# Altium schematic sheet 23 Unused.SchDoc
size 420 x 297 mm; Address1: Address1; Address2: Address2; Address3: Address3; Address4: Address4; DocumentNumber: АБВГ.123456.001 Э3; SheetNumber: 23; SheetTotal: 23; Scale: 1:1; DocumentType: Схема электрическая принципиальная; FirstReferrence: АБВГ.123456.001
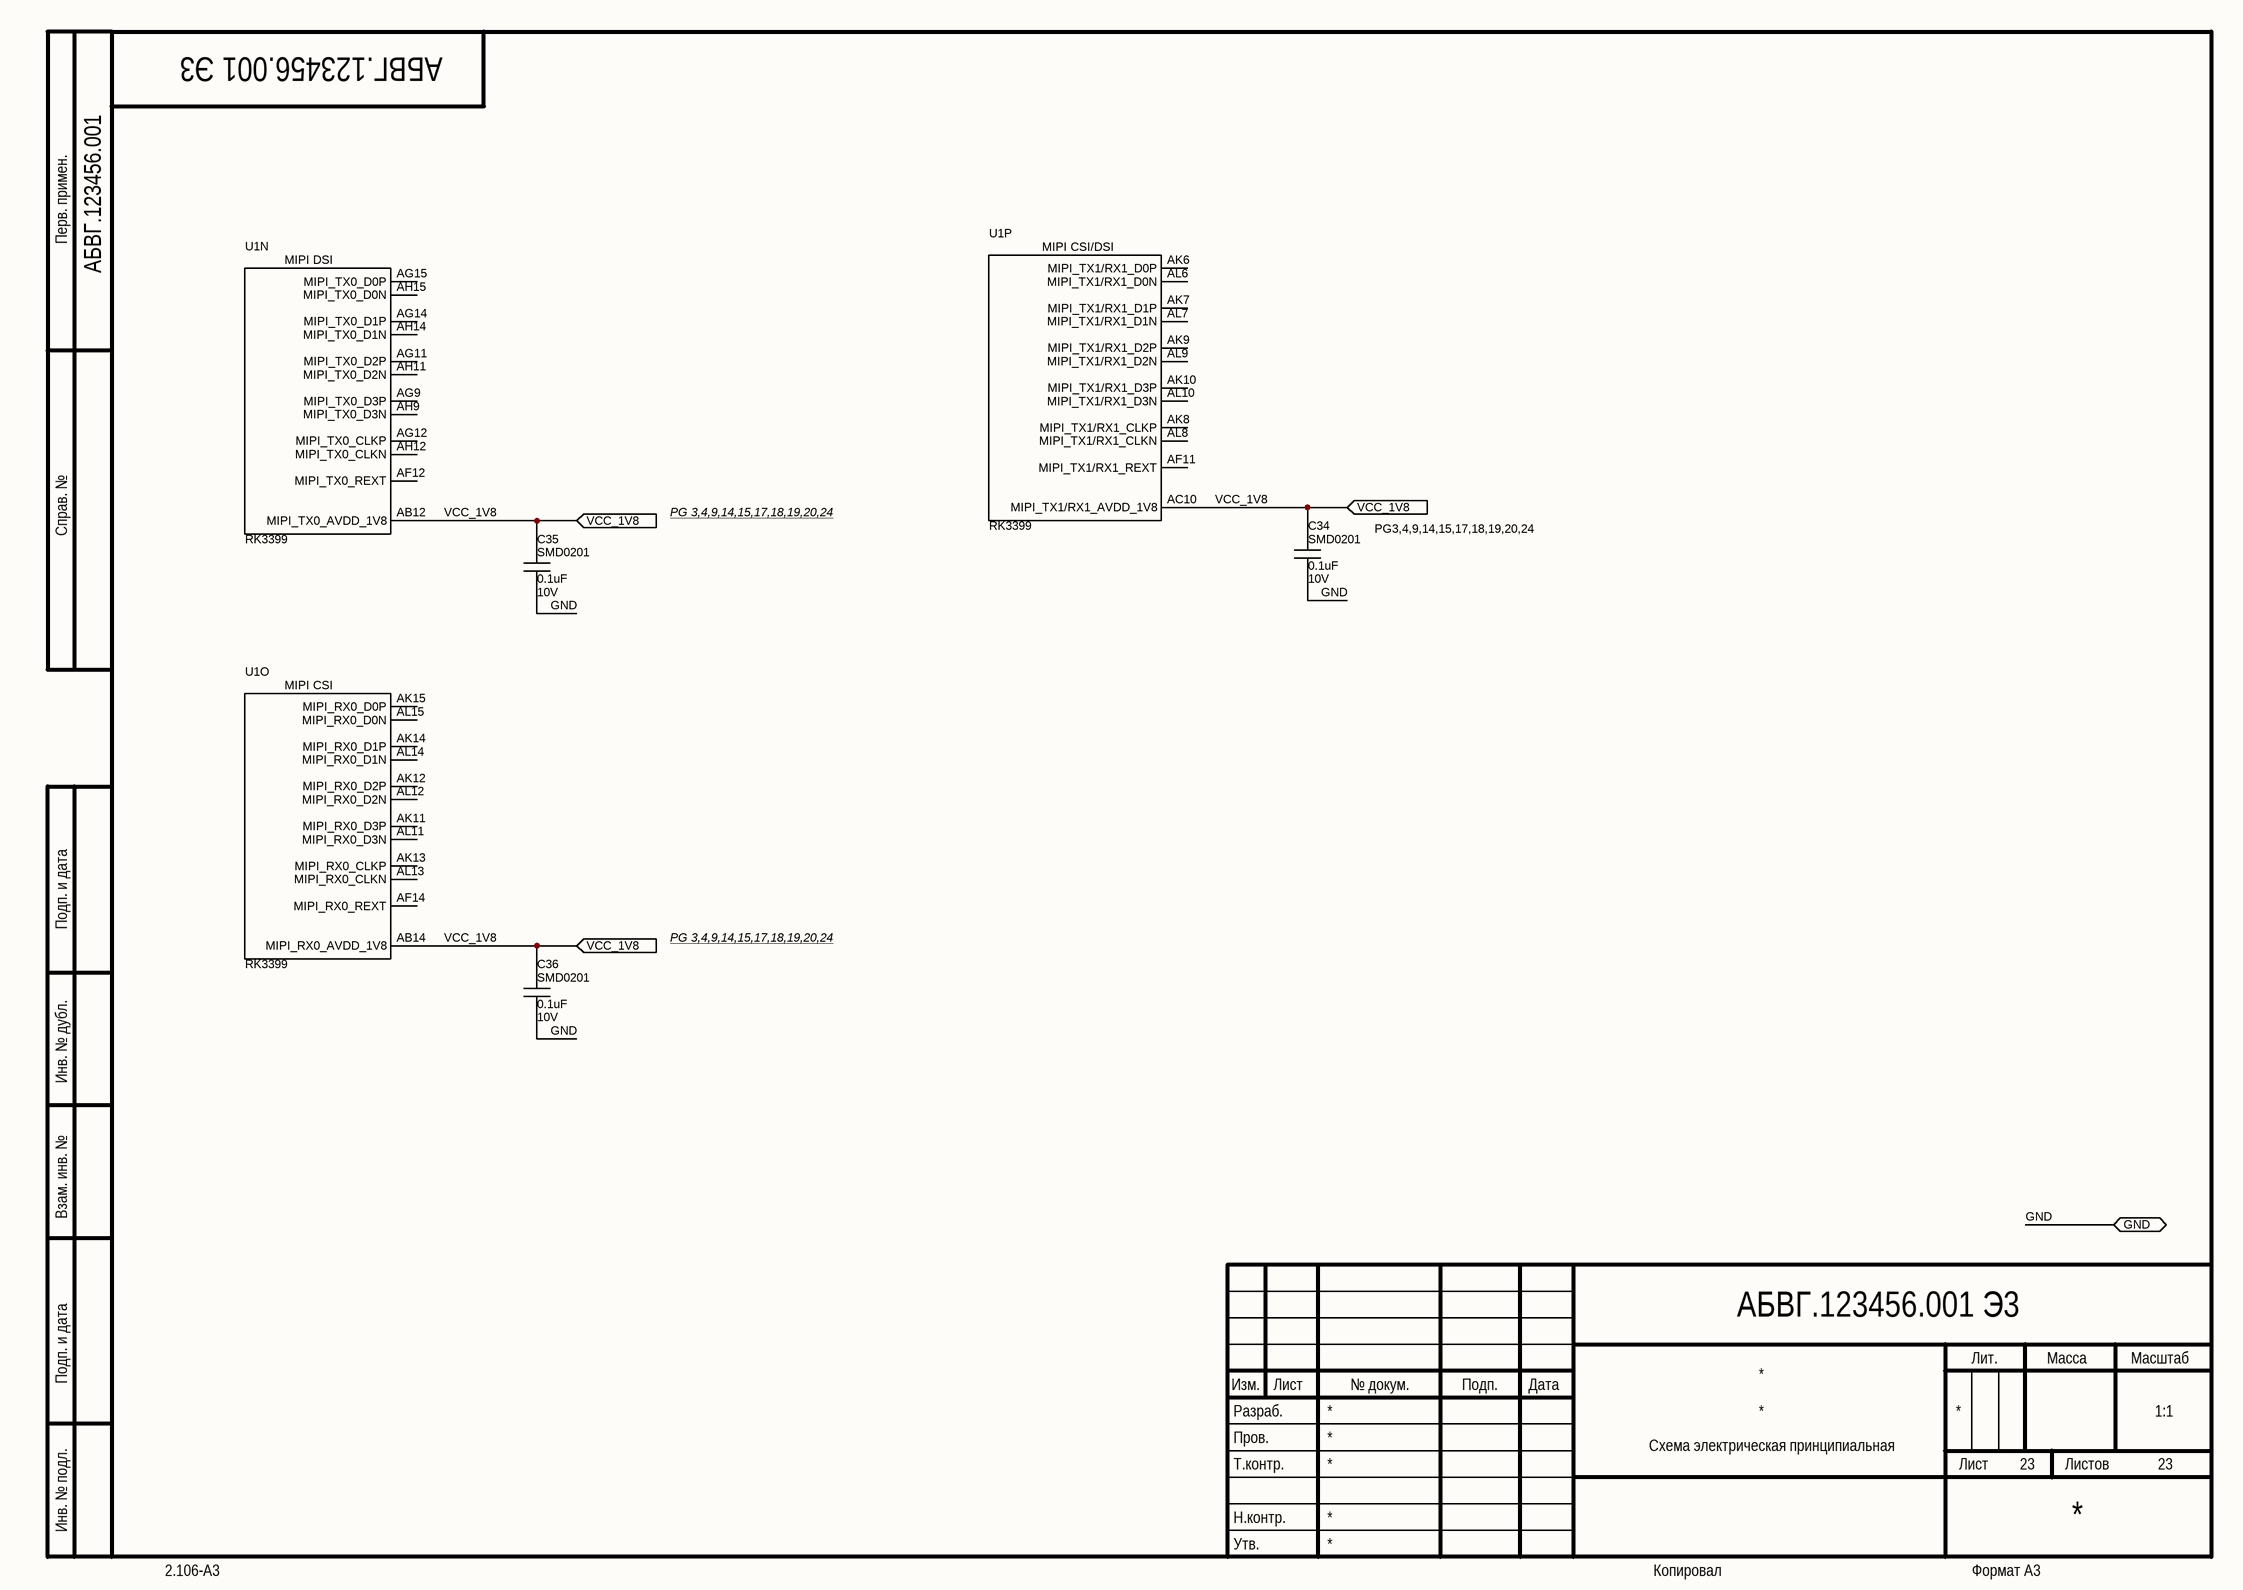
[diagram p0: 23 Unused.SchDoc]

## Parts
C34  Package: SMD0201  Voltage: 10V  [CAP_SMD_0201]  (hidden comment: 0.1uF)
C35  Package: SMD0201  Voltage: 10V  [CAP_SMD_0201]  (hidden comment: 0.1uF)
C36  Package: SMD0201  Voltage: 10V  [CAP_SMD_0201]  (hidden comment: 0.1uF)
U1  value RK3399  [BGA828C65P31X31_2100X2100X161N]  (hidden comment: RK3399_FF)  (parts N,O,P of 23)

## Ports
GND (bidir), VCC_1V8 (in)

## Nets
GND: C34.2 C35.2 C36.2 ; port GND
VCC_1V8: C34.1 C35.1 C36.1 U1.AB12(MIPI_TX0_AVDD_1V8) U1.AB14(MIPI_RX0_AVDD_1V8) U1.AC10(MIPI_TX1/RX1_AVDD_1V8) ; port VCC_1V8

Not connected (* = marked no-connect by the designer): U1 AF11(MIPI_TX1/RX1_REXT) AF12(MIPI_TX0_REXT) AF14(MIPI_RX0_REXT) AG9(MIPI_TX0_D3P) AG11(MIPI_TX0_D2P) AG12(MIPI_TX0_CLKP) AG14(MIPI_TX0_D1P) AG15(MIPI_TX0_D0P) AH9(MIPI_TX0_D3N) AH11(MIPI_TX0_D2N) AH12(MIPI_TX0_CLKN) AH14(MIPI_TX0_D1N) AH15(MIPI_TX0_D0N) AK6(MIPI_TX1/RX1_D0P) AK7(MIPI_TX1/RX1_D1P) AK8(MIPI_TX1/RX1_CLKP) AK9(MIPI_TX1/RX1_D2P) AK10(MIPI_TX1/RX1_D3P) AK11(MIPI_RX0_D3P) AK12(MIPI_RX0_D2P) AK13(MIPI_RX0_CLKP) AK14(MIPI_RX0_D1P) AK15(MIPI_RX0_D0P) AL6(MIPI_TX1/RX1_D0N) AL7(MIPI_TX1/RX1_D1N) AL8(MIPI_TX1/RX1_CLKN) AL9(MIPI_TX1/RX1_D2N) AL10(MIPI_TX1/RX1_D3N) AL11(MIPI_RX0_D3N) AL12(MIPI_RX0_D2N) AL13(MIPI_RX0_CLKN) AL14(MIPI_RX0_D1N) AL15(MIPI_RX0_D0N)

## Notes on the sheet
- Перв. примен.
- Справ. №
- PG 3,4,9,14,15,17,18,19,20,24
- PG3,4,9,14,15,17,18,19,20,24
- Подп. и дата
- Инв. № дубл.
- Взам. инв. №
- Разраб.
- Изм.
- Лист
- № докум.
- Подп.
- Дата
- Лит.
- Масса
- Масштаб
- Пров.
- Т.контр.
- Листов
- Инв. № подл.
- Утв.
- Н.контр.
- 2.106-A3
- Копировал
- Формат А3
- (in symbol RK3399_FF, part N) MIPI DSI
- (in symbol RK3399_FF, part O) MIPI CSI
- (in symbol RK3399_FF, part P) MIPI CSI/DSI

## Library data of the parts
C34-C36 = Ceramic_Cap: PartNumber: CC0201KRX5R6BB104; ComponentType: SMD Ceramic Chip Capacitor; Manufacter: *; Tolerance: *; ClassName: *; Value: 0.1uF
U1 = RK3399_FF: Package: BGA828; ComponentType: *; Manufacter: *; PartNumber: RK3399; ClassName: *